# EAGLE design GBZP (EAGLE 8.4.1)
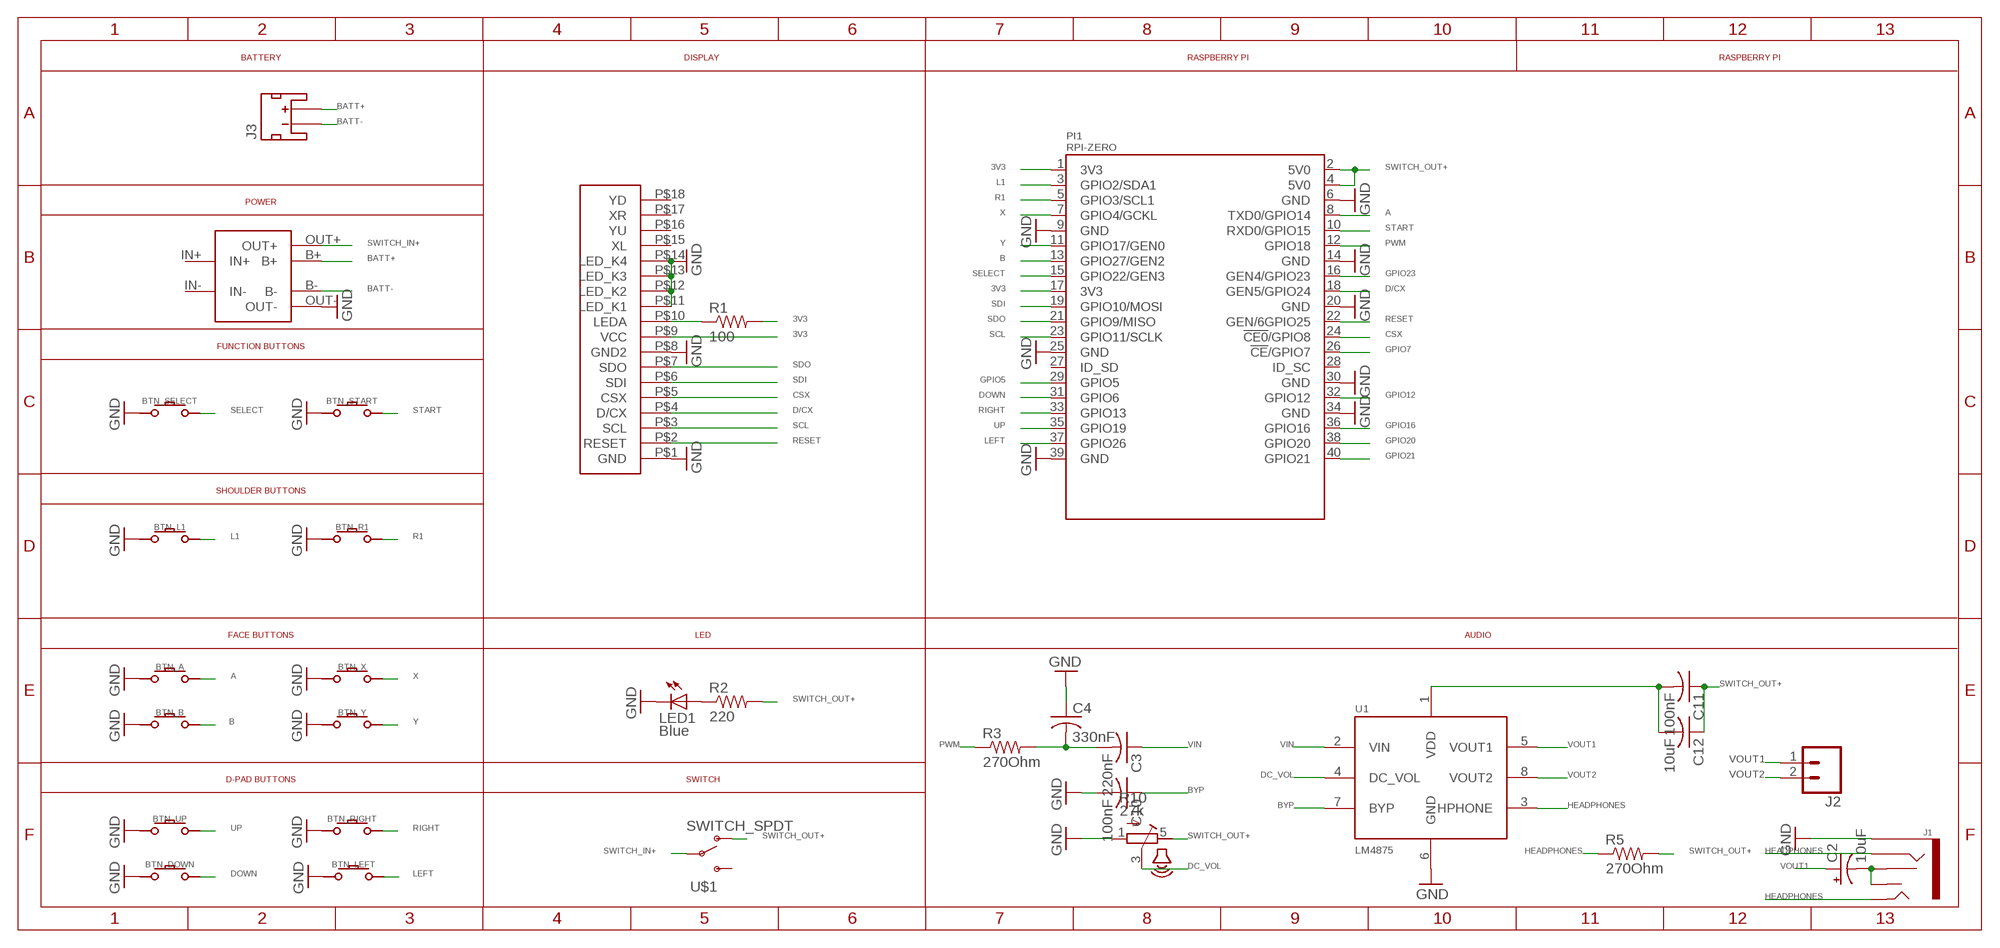
[diagram p0: schematic, sheet 1]

## Parts
BTN_A  PAD+SWITCH+HOLE  [PAD+SWITCH+HOLE]
BTN_B  PAD+SWITCH+HOLE  [PAD+SWITCH+HOLE]
BTN_DOWN  PAD+SWITCH+HOLE  [PAD+SWITCH+HOLE]
BTN_L1  PAD+SWITCH+HOLE  [PAD+SWITCH+HOLE]
BTN_LEFT  PAD+SWITCH+HOLE  [PAD+SWITCH+HOLE]
BTN_R1  PAD+SWITCH+HOLE  [PAD+SWITCH+HOLE]
BTN_RIGHT  PAD+SWITCH+HOLE  [PAD+SWITCH+HOLE]
BTN_SELECT  PAD+SWITCH+HOLE  [PAD+SWITCH+HOLE]
BTN_START  PAD+SWITCH+HOLE  [PAD+SWITCH+HOLE]
BTN_UP  PAD+SWITCH+HOLE  [PAD+SWITCH+HOLE]
BTN_X  PAD+SWITCH+HOLE  [PAD+SWITCH+HOLE]
BTN_Y  PAD+SWITCH+HOLE  [PAD+SWITCH+HOLE]
C2  10uF  10UF-POLAR-EIA3216-16V-10%(TANT)  [EIA3216]
C3  220nF  C-USC0805  [C0805]
C4  330nF  C-USC0805  [C0805]
C10  100nF  C-USC0805  [C0805]
C11  100nF  C-USC0805  [C0805]
C12  10uF  C-USC0805  [C0805]
ILI9341-TFT-2.8  GAMEBOYZEROHANDHELDDISPLAYS-2.8  [GAMEBOYZEROHANDHELDDISPLAYS-2.8]
J1  AUDIO_JACK_3.5MM_PTH  [AUDIO-JACK]
J2  CONN_02  [1X02]
J3  JST_2MM_MALE  [JST-2-SMD]
LED1  Blue  LEDCHIPLED_0805  [CHIPLED_0805]
PI1  RPI-ZERO  [RASPBERRYPI_BASTELSTUBE_V13_RASPI_BOARD_B+_FULL]
POWER1  03962A  [03962A]
R1  100  R-US_R0805  [R0805]
R2  220  R-US_R0805  [R0805]
R3  270Ohm  R-US_R0805  [R0805]
R5  270Ohm  R-US_R0805  [R0805]
R10  27k  VOLUME  [VOLUME]
U1  LM4875  [SOIC8]
U$1  SWITCH_SPDT  [KPS-1290]

## Nets
3V3: ILI9341-TFT-2.8.P$9(VCC) PI1.1(3V3) PI1.17(3V3) R1.2
3V3100OHM: ILI9341-TFT-2.8.P$10(LEDA) R1.1
A: BTN_A.P$ACTIVE PI1.8(TXD0/GPIO14)
B: BTN_B.P$ACTIVE PI1.13(GPIO27/GEN2)
BATT+: J3.2(+) POWER1.B+
BATT-: J3.1(-) POWER1.B-
BYP: C10.1 U1.7(BYP)
CAP_LINE: C11.2 C12.2 U1.1(VDD)
CAP_LINE_JACK: C2.- J1.RSH J1.TSH
CSX: ILI9341-TFT-2.8.P$5(CSX) PI1.24(!CE0!/GPIO8)
D/CX: ILI9341-TFT-2.8.P$4(D/CX) PI1.18(GEN5/GPIO24)
DC_VOL: R10.3(S) U1.4(DC_VOL)
DOWN: BTN_DOWN.P$ACTIVE PI1.31(GPIO6)
GND: BTN_A.P$GND BTN_B.P$GND BTN_DOWN.P$GND BTN_L1.P$GND BTN_LEFT.P$GND BTN_R1.P$GND BTN_RIGHT.P$GND BTN_SELECT.P$GND BTN_START.P$GND BTN_UP.P$GND BTN_X.P$GND BTN_Y.P$GND C4.1 C10.2 ILI9341-TFT-2.8.P$1(GND) ILI9341-TFT-2.8.P$8(GND2) ILI9341-TFT-2.8.P$11(LED_K1) ILI9341-TFT-2.8.P$12(LED_K2) ILI9341-TFT-2.8.P$13(LED_K3) ILI9341-TFT-2.8.P$14(LED_K4) J1.SLEEVE LED1.C PI1.6(GND) PI1.9(GND) PI1.14(GND) PI1.20(GND) PI1.25(GND) PI1.30(GND) PI1.34(GND) PI1.39(GND) POWER1.OUT- R10.1(A) U1.6(GND)
GPIO5: PI1.29(GPIO5)
GPIO7: PI1.26(!CE!/GPIO7)
GPIO12: PI1.32(GPIO12)
GPIO16: PI1.36(GPIO16)
GPIO20: PI1.38(GPIO20)
GPIO21: PI1.40(GPIO21)
GPIO23: PI1.16(GEN4/GPIO23)
HEADPHONES: J1.RING J1.TIP R5.1 U1.3(HPHONE)
L1: BTN_L1.P$ACTIVE PI1.3(GPIO2/SDA1)
LED: LED1.A R2.1
LEFT: BTN_LEFT.P$ACTIVE PI1.37(GPIO26)
N$2: C3.2 C4.2 R3.2
PWM: PI1.12(GPIO18) R3.1
R1: BTN_R1.P$ACTIVE PI1.5(GPIO3/SCL1)
RESET: ILI9341-TFT-2.8.P$2(RESET) PI1.22(GEN/6GPIO25)
RIGHT: BTN_RIGHT.P$ACTIVE PI1.33(GPIO13)
SCL: ILI9341-TFT-2.8.P$3(SCL) PI1.23(GPIO11/SCLK)
SDI: ILI9341-TFT-2.8.P$6(SDI) PI1.19(GPIO10/MOSI)
SDO: ILI9341-TFT-2.8.P$7(SDO) PI1.21(GPIO9/MISO)
SELECT: BTN_SELECT.P$ACTIVE PI1.15(GPIO22/GEN3)
START: BTN_START.P$ACTIVE PI1.10(RXD0/GPIO15)
SWITCH_IN+: POWER1.OUT+ U$1.P
SWITCH_OUT+: C11.1 C12.1 PI1.2(5V0) PI1.4(5V0) R2.2 R5.2 R10.5(E) U$1.O
UP: BTN_UP.P$ACTIVE PI1.35(GPIO19)
VIN: C3.1 U1.2(VIN)
VOUT1: C2.+ J2.1 U1.5(VOUT1)
VOUT2: J2.2 U1.8(VOUT2)
X: BTN_X.P$ACTIVE PI1.7(GPIO4/GCKL)
Y: BTN_Y.P$ACTIVE PI1.11(GPIO17/GEN0)
Unconnected: ILI9341-TFT-2.8.P$15(XL) ILI9341-TFT-2.8.P$16(YU) ILI9341-TFT-2.8.P$17(XR) ILI9341-TFT-2.8.P$18(YD) J3.NC1(PAD1) J3.NC2(PAD2) PI1.27(ID_SD) PI1.28(ID_SC) POWER1.IN+ POWER1.IN- U$1.S

## Notes on the sheet
- BATTERY | DISPLAY | RASPBERRY PI | RASPBERRY PI
- POWER
- FUNCTION BUTTONS
- SHOULDER BUTTONS
- FACE BUTTONS | LED | AUDIO
- D-PAD BUTTONS | SWITCH

## Library data of the parts
BTN_A BTN_B BTN_DOWN BTN_L1 BTN_LEFT BTN_R1 BTN_RIGHT BTN_SELECT BTN_START BTN_UP BTN_X BTN_Y = pad+switch+hole:PAD+SWITCH+HOLE
C2 = SparkFun-Capacitors:10UF-POLAR: 10.0µF polarized capacitors A capacitor is a passive two-terminal electrical component used to store electrical energy temporarily in an electric field.; PROD_ID: CAP-00811
C3 C4 C10-C12 = adafruit:C-US: CAPACITOR, American symbol
ILI9341-TFT-2.8 = GameboyZeroHandheldDisplays:GAMEBOYZEROHANDHELDDISPLAYS-2.8
J1 = SparkFun-Connectors:AUDIO_JACK_3.5MM: Audio Jack 3.5mm variants of PTH and SMT stereo audio jack with bypass switches. SparkFun Products: SparkFun SparkPunk Sound Kit <[https://www.sparkfun.com/products/11177]> - PTH MP3 Trigger <https://www.sparkfun.com/products/13720> -3.5mm SMD SparkFun PicoBoard <https://www.sparkfun.com/products/11888>- 2.5mm SMD; PROD_ID: CONN-08774; SF_ID: PRT-08032
J2 = SparkFun-Connectors:CONN_02: Multi connection point. Often used as Generic Header-pin footprint for 0.1 inch spaced/style header connections On any of the 0.1 inch spaced packages, you can populate with these: Break Away Headers - Straight <https://www.sparkfun.com/products/116> (PRT-00116) Break Away Male Headers - Right Angle <https://www.sparkfun.com/products/553> (PRT-00553) Female Headers <https://www.sparkfun.com/products/115> (PRT-00115) Break Away Headers - Machine Pin <https://www.sparkfun.com/products/117> (PRT-00117) Break Away Female Headers - Swiss Machine Pin <https://www.sparkfun.com/products/743> (PRT-00743) For SCREWTERMINALS and SPRING TERMINALS visit here: Screw Terimnals on SparkFun.com <https://www.sparkfun.com/search/results?term=Screw+Terminals> (5mm/3.5mm/2.54mm spacing) This device is also useful as a general connection point to wire up your design to another part of your project. Our various solder wires solder well into these plated through hole pads. Hook-Up Wire - Assortment (Stranded, 22 AWG) <https://www.sparkfun.com/products/11375> (PRT-11375) Hook-Up Wire - Assortment (Solid Core, 22 AWG) <https://www.sparkfun.com/products/11367> (PRT-11367) View the entire wire category on our website here <https://www.sparkfun.com/categories/141> Special notes: Molex polarized connector foot print use with: PRT-08233 with associated crimp pins and housings. 2.54_SCREWTERM for use with PRT-10571. 3.5mm Screw Terminal footprints for PRT-08084 5mm Screw Terminal footprints for use with PRT-08432
J3 = SparkFun-Connectors:JST_2MM_MALE: Mates to single-cell LiPo batteries. CONN-11443 Now with smashable polarity marks!; BTM_NEG: -; BTM_POS: +; PROD_ID: CONN-11443; TOP_NEG: -; TOP_POS: +
LED1 = adafruit:LED: LED OSRAM: - CHIPLED LG R971, LG N971, LY N971, LG Q971, LY Q971, LO R971, LY R971 LH N974, LH R974 LS Q976, LO Q976, LY Q976 LO Q996 - Hyper CHIPLED LW Q18S LB Q993, LB Q99A, LB R99A - SideLED LS A670, LO A670, LY A670, LG A670, LP A670 LB A673, LV A673, LT A673, LW A673 LH A674 LY A675 LS A676, LA A676, LO A676, LY A676, LW A676 LS A679, LY A679, LG A679 - Hyper Micro SIDELED® LS Y876, LA Y876, LO Y876, LY Y876 LT Y87S - SmartLED LW L88C, LW L88S LB L89C, LB L89S, LG L890 LS L89K, LO L89K, LY L89K LS L896, LA L896, LO L896, LY L896 - TOPLED LS T670, LO T670, LY T670, LG T670, LP T670 LSG T670, LSP T670, LSY T670, LOP T670, LYG T670 LG T671, LOG T671, LSG T671 LB T673, LV T673, LT T673, LW T673 LH T674 LS T676, LA T676, LO T676, LY T676, LB T676, LH T676, LSB T676, LW T676 LB T67C, LV T67C, LT T67C, LS T67K, LO T67K, LY T67K, LW E67C LS E67B, LA E67B, LO E67B, LY E67B, LB E67C, LV E67C, LT E67C LW T67C LS T679, LY T679, LG T679 LS T770, LO T770, LY T770, LG T770, LP T770 LB T773, LV T773, LT T773, LW T773 LH T774 LS E675, LA E675, LY E675, LS T675 LS T776, LA T776, LO T776, LY T776, LB T776 LHGB T686 LT T68C, LB T68C - Hyper Mini TOPLED® LB M676 - Mini TOPLED Santana® LG M470 LS M47K, LO M47K, LY M47K Source: http://www.osram.convergy.de/
PI1 = RPI-Zero:RPI-ZERO
POWER1 = 03962A:03962A
R1-R3 R5 = adafruit:R-US_: RESISTOR, American symbol
R10 = GBA:VOLUME
U1 = texas:LM4875
U$1 = SparkFun-Retired:SWITCH_SPDT: SWCH-10651 Side-actuated SPDT slide switch, as used on the Arduino Pro; PROD_ID: SWCH-10651

## Board
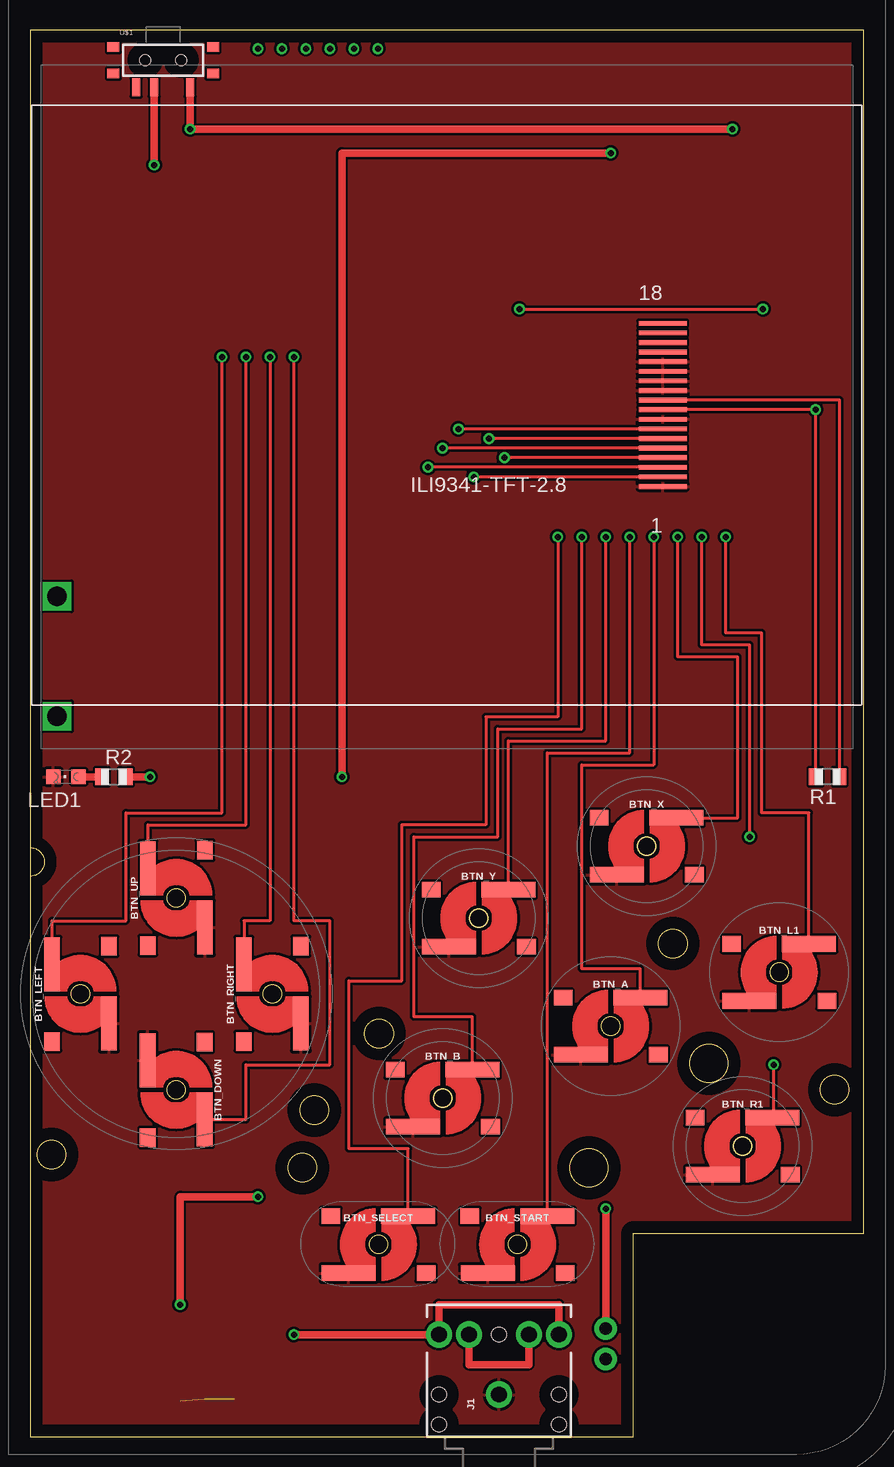
[diagram p1: board, top side]
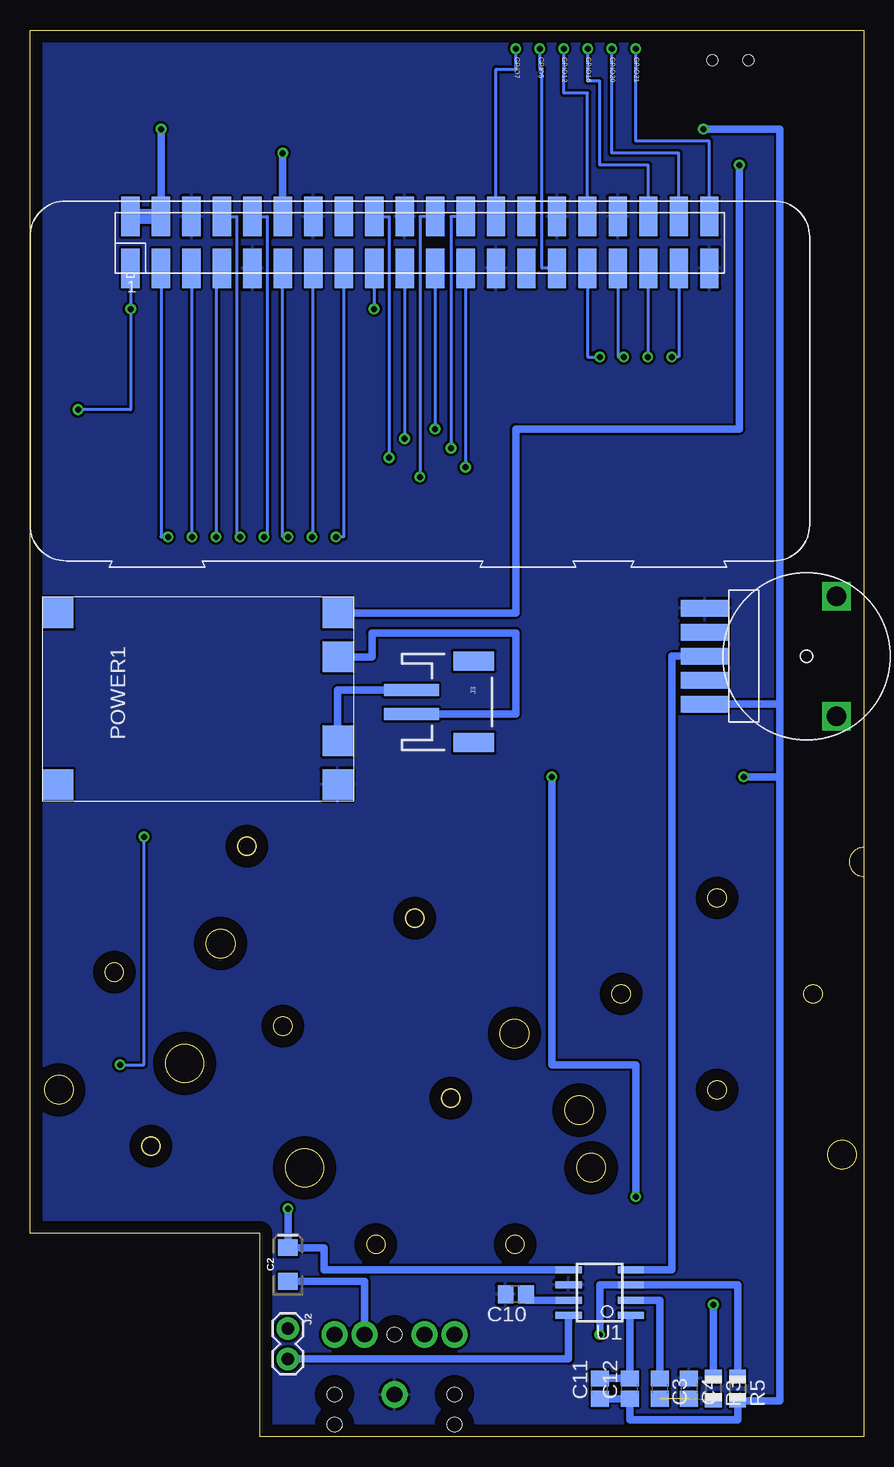
[diagram p2: board, bottom side, seen from below]

Size 69.5 x 117.25 mm. Coordinates in mm from the lower left corner, seen from the top.
Outline: 0,46.7 0,0 50.3,0 50.3,16.95 69.5,16.95 69.5,117.25 0,117.25 0,49.1
Outline: 0,49.1 0,46.7
Outline: 0,49.1 arc-180 0,46.7
Outline: circle at 1.8,23.5 radius 1.2
Outline: circle at 67.1,28.9 radius 1.2
Outline: circle at 56.6,31.1 radius 1.6
Outline: circle at 46.6,22.4 radius 1.6
Outline: circle at 29.1,33.6 radius 1.2
Outline: circle at 23.7,27.2 radius 1.2
Outline: circle at 22.7,22.4 radius 1.2
Outline: circle at 53.6,41.1 radius 1.2
Outline: circle at 34.42,28.21 radius 0.75
Outline: circle at 37.42,43.21 radius 0.75
Outline: circle at 51.42,49.21 radius 0.75
Outline: circle at 59.42,24.21 radius 0.75
Copper layers (1*16): Top 0.035mm / dielectric 1.5mm / Bottom 0.035mm
Design rules "default": minimum track width 10mil, minimum drill 24mil, track to track 8mil, track to pad 8mil, pad to pad 8mil, via to via 8mil, smd to smd 8mil, copper to edge 40mil, drill to drill 8mil, minimum pad ring 10mil, minimum via ring 8mil, stop-mask expansion 4mil, vias tented up to drill 0mil, thermal gap 10mil

### Footprints (pad centres in the part's own frame; a part is rotated, then mirrored left to right if it is on the bottom)
PAD+SWITCH+HOLE = smd 4.5 x 1.3: P$ACTIVE 2.475,2.365; P$GND -2.475,-2.385 | smd 1.55 x 1.3: P$NC -3.975,2.365; P$NC2 3.975,-2.385 | hole 1.5: 0,0
EIA3216 = smd 1.4 x 1.6: + 1.4,0; - -1.4,0
C0805 = smd 1.3 x 1.5: 1 -0.85,0; 2 0.85,0
GAMEBOYZEROHANDHELDDISPLAYS-2.8 = smd 4 x 0.4: P$1 -18,6.8; P$2 -18,6; P$3 -18,5.2; P$4 -18,4.4; P$5 -18,3.6; P$6 -18,2.8; P$7 -18,2; P$8 -18,1.2; P$9 -18,0.4; P$10 -18,-0.4; P$11 -18,-1.2; P$12 -18,-2; P$13 -18,-2.8; P$14 -18,-3.6; P$15 -18,-4.4; P$16 -18,-5.2; P$17 -18,-6; P$18 -18,-6.8
AUDIO-JACK = drill 1.3 pad 2.184: RING 5,5; RSH 5,2.5; SLEEVE 0,0; TIP 5,-5; TSH 5,-2.5 | hole 1.2: 0,5; -2.5,5; -2.5,-5; 0,-5; 5,0
1X02 = drill 1.016 pad 1.88: 1 0,0; 2 2.54,0
JST-2-SMD = smd 1 x 4.6: 1 -1,-3.7; 2 1,-3.7 | smd 1.6 x 3.4: NC1 -3.4,1.5; NC2 3.4,1.5
CHIPLED_0805 = smd 1.2 x 1.2: A 0,-1.05; C 0,1.05
RASPBERRYPI_BASTELSTUBE_V13_RASPI_BOARD_B+_FULL = smd 1.524 x 3.302: 1 8.382,24.384; 2 8.382,28.702; 3 10.922,24.384; 4 10.922,28.702; 5 13.462,24.384; 6 13.462,28.702; 7 16.002,24.384; 8 16.002,28.702; 9 18.542,24.384; 10 18.542,28.702; 11 21.082,24.384; 12 21.082,28.702; 13 23.622,24.384; 14 23.622,28.702; 15 26.162,24.384; 16 26.162,28.702; 17 28.702,24.384; 18 28.702,28.702; 19 31.242,24.384; 20 31.242,28.702; 21 33.782,24.384; 22 33.782,28.702; 23 36.322,24.384; 24 36.322,28.702; 25 38.862,24.384; 26 38.862,28.702; 27 41.402,24.384; 28 41.402,28.702; 29 43.942,24.384; 30 43.942,28.702; 31 46.482,24.384; 32 46.482,28.702; 33 49.022,24.384; 34 49.022,28.702; 35 51.562,24.384; 36 51.562,28.702; 37 54.102,24.384; 38 54.102,28.702; 39 56.642,24.384; 40 56.642,28.702
03962A = smd 2.54 x 2.54: B+ 12,1.35; B- 5,1.35; IN+ 15.65,24.65; IN- 1.35,24.65; OUT+ 15.65,1.35; OUT- 1.35,1.35
R0805 = smd 1.1 x 1.4: 1 -1,0; 2 1,0
VOLUME = smd 1.4 x 4: 1 -4,-2; 2 -2,-2; 3 0,-2; 4 2,-2; 5 4,-2 | drill 1.6 square: P$6 -5,9; P$7 5,9
SOIC8 = smd 0.6 x 2.2: 1 -1.905,-2.6; 2 -0.635,-2.6; 3 0.635,-2.6; 4 1.905,-2.6; 5 1.905,2.6; 6 0.635,2.6; 7 -0.635,2.6; 8 -1.905,2.6
KPS-1290 = smd 0.7 x 1.5: O -2.25,2.25; P 0.75,2.25; S 2.25,2.25 | smd 1 x 0.8: P$1 -4.15,1.1; P$2 -4.15,-1.1; P$3 4.15,-1.1; P$4 4.15,1.1 | hole 0.9: -1.5,0; 1.5,0

### Placement (x,y rotation side)
BTN_A  48.42,34.21 0 top
BTN_B  34.42,28.21 0 top
BTN_DOWN  12.2,28.9 270 top
BTN_L1  62.47,38.7 0 top
BTN_LEFT  4.2,36.9 90 top
BTN_R1  59.42,24.21 0 top
BTN_RIGHT  20.2,36.9 90 top
BTN_SELECT  29.05,16.01 0 top
BTN_START  40.66,16.01 0 top
BTN_UP  12.2,44.9 90 top
BTN_X  51.42,49.21 0 top
BTN_Y  37.42,43.21 0 top
C2  48,14.35 90 bottom
C3  17,4 270 bottom
C4  14.55,4 270 bottom
C10  29,11.87 180 bottom
C11  22,4 90 bottom
C12  19.5,4 90 bottom
ILI9341-TFT-2.8  34.75,86 180 top
J1  39.1,3.5 90 top
J2  48,9 270 bottom
J3  34,61.25 270 bottom
LED1  3,55 90 top
PI1  69.5,73 0 bottom
POWER1  42.5,53 90 bottom
R1  66.5,55 180 top
R2  7,55 0 top
R3  12.53,4 270 bottom
R5  10.5,4 270 bottom
R10  11.25,65.05 270 bottom
U1  22,12 90 bottom
U$1  11.1,114.72 180 top

### Tracks (layer width: path | path; a pad name or v marks a point on that pad's centre or on a via)
3V3  (via drill 0.5)
  Top 0.254: R1.2 v65.5,85.6 ILI9341-TFT-2.8.P$9 | v40.8,94 v61.12,94
  Bottom 0.254: v65.5,85.6 61.12,85.6 v61.12,94 PI1.1 | PI1.17 v40.8,94
3V3100OHM
  Top 0.254: R1.1 67.5,86.4 ILI9341-TFT-2.8.P$10
A  (via drill 0.5)
  Top 0.254: v52,75 52,56 46,56 46,39 50.9,39 BTN_A.P$ACTIVE
  Bottom 0.254: PI1.8 52.25,101.7 52.25,75 v52,75
B  (via drill 0.5)
  Top 0.254: BTN_B.P$ACTIVE 36.9,35 32,35 32,50 39,50 39,59 46,59 v46,75
  Bottom 0.254: PI1.13 45.88,75 v46,75
BATT+
  Bottom 0.61: J3.2 29,60.25 29,67 41,67 41,65 POWER1.B+
BATT-
  Bottom 0.61: J3.1 43.85,62.25 POWER1.B-
BYP
  Bottom 0.61: U1.7 28.15,11.37 C10.1
CAP_LINE
  Bottom 0.61: U1.1 19.5,10.1 C12.2 C11.2
CAP_LINE_JACK
  Top 0.61: J1.RSH 36.6,6 41.6,6 J1.TSH
  Bottom 0.61: C2.- 41.6,12.95 J1.TSH
CSX  (via drill 0.5)
  Top 0.254: ILI9341-TFT-2.8.P$5 v34.4,82.4
  Bottom 0.254: PI1.24 34.4,101.7 v34.4,82.4
D/CX  (via drill 0.5)
  Top 0.254: ILI9341-TFT-2.8.P$4 v39.55,81.6
  Bottom 0.254: PI1.18 39.55,101.7 v39.55,81.6
DC_VOL
  Bottom 0.61: R10.3 16,65.05 16,13.9 U1.4
DOWN  (via drill 0.5)
  Top 0.254: BTN_DOWN.P$ACTIVE 18,26.43 18,31 25,31 25,43 22,43 v22,90
  Bottom 0.254: PI1.31 23.02,90 v22,90
GND
  pour Top: 0,0 50.3,0 50.3,16.95 69.5,16.95 69.5,117.25 0,117.25
  pour Bottom: 0,0 50.3,0 50.3,16.95 69.5,16.95 69.5,117.25 0,117.25
GPIO5  (via drill 0.5)
  Bottom 0.254: PI1.29 26.8,97.38 26.8,114 27,114 v27,115.7
GPIO7  (via drill 0.5)
  Bottom 0.254: PI1.26 30.64,114 29,114 v29,115.7
GPIO12  (via drill 0.5)
  Bottom 0.254: PI1.32 23.02,112 25,112 v25,115.7
GPIO16  (via drill 0.5)
  Bottom 0.254: PI1.36 17.94,106 22,106 22,113 23,113 v23,115.7
GPIO20  (via drill 0.5)
  Bottom 0.254: PI1.38 15.4,107 21,107 v21,115.7
GPIO21  (via drill 0.5)
  Bottom 0.254: PI1.40 12.86,108 19,108 v19,115.7
HEADPHONES  (via drill 0.5)
  Top 0.61: v22,8.5 J1.RING 34.1,11 44.1,11 J1.TIP
  Bottom 0.61: R5.1 10.5,12.63 U1.3 22,12.63 v22,8.5
L1  (via drill 0.5)
  Top 0.254: BTN_L1.P$ACTIVE 64.94,52 61,52 61,67 58,67 v58,75
  Bottom 0.254: PI1.3 58.58,75 v58,75
LED
  Top 0.61: R2.1 LED1.A
LEFT  (via drill 0.5)
  Top 0.254: BTN_LEFT.P$ACTIVE 1.83,43 8,43 8,52 16,52 v16,90
  Bottom 0.254: PI1.37 15.4,90 v16,90
N$2  (2 unrouted)
PWM  (via drill 0.5)
  Top 0.61: v12.53,11 12.53,20 v19,20 | v26,55 26,107 v48.42,107 48,107
  Bottom 0.61: R3.1 v12.53,11 | v19,20 19,31 26,31 v26,55 | PI1.12 v48.42,107
R1  (via drill 0.5)
  Top 0.254: BTN_R1.P$ACTIVE 62,26.57 v62,31 | v60,50 60,66 56,66 v56,75
  Bottom 0.254: PI1.5 56.04,75 v56,75 | v62,31 60,31 v60,50
RESET  (via drill 0.5)
  Top 0.254: ILI9341-TFT-2.8.P$2 v37,80
  Bottom 0.254: PI1.22 37,101.7 v37,80
RIGHT  (via drill 0.5)
  Top 0.254: v20,90 20,43 17.84,43 BTN_RIGHT.P$ACTIVE
  Bottom 0.254: PI1.33 20.48,90 v20,90
SCL  (via drill 0.5)
  Top 0.254: ILI9341-TFT-2.8.P$3 v33.18,80.8
  Bottom 0.254: PI1.23 v33.18,80.8 33.2,80.8
SDI  (via drill 0.5)
  Top 0.254: ILI9341-TFT-2.8.P$6 v38.26,83.2
  Bottom 0.254: PI1.19 v38.26,83.2
SDO  (via drill 0.5)
  Top 0.254: ILI9341-TFT-2.8.P$7 v35.72,84
  Bottom 0.254: PI1.21 v35.72,84
  Bottom 0.406: v35.72,84 36,84
SELECT  (via drill 0.5)
  Top 0.254: BTN_SELECT.P$ACTIVE 31.53,24 26.6,24 26.6,38 31,38 31,51 38,51 38,60 44,60 v44,75
  Bottom 0.254: PI1.15 43.34,75 v44,75
START  (via drill 0.5)
  Top 0.254: BTN_START.P$ACTIVE 43.13,57 50,57 v50,75
  Bottom 0.254: PI1.10 49.7,101.7 49.7,75 v50,75
SWITCH_IN+  (via drill 0.5)
  Top 0.61: U$1.P v10.35,106
  Bottom 0.61: POWER1.OUT+ 29,68.65 29,84 10.35,84 v10.35,106
SWITCH_OUT+  (via drill 0.5)
  Top 0.61: U$1.O v13.35,109 v58.58,109 | R2.2 v10,55 | v58.58,109 58.6,109 v58.58,109
  Bottom 0.61: v58.58,109 PI1.4 | v13.35,109 7,109 7,61.05 | 7,61.05 R10.5 | 7,55 7,61.05 | 7,55 7,3 R5.2 10.5,1.4 19.5,1.4 C12.1 C11.1 | v10,55 7,55
  Bottom 1.27: PI1.4 PI1.2
UP  (via drill 0.5)
  Top 0.254: BTN_UP.P$ACTIVE 9.84,51 18,51 v18,90
  Bottom 0.254: PI1.35 18,97.38 v18,90
VIN
  Bottom 0.61: C3.1 17,11.37 U1.2
VOUT1  (via drill 0.5)
  Top 0.61: J2.1 v48,19
  Bottom 0.61: U1.5 45,13.9 45,15.75 C2.+ v48,19
VOUT2
  Bottom 0.61: U1.8 24.6,6.46 J2.2
X  (via drill 0.5)
  Top 0.254: BTN_X.P$ACTIVE 59,51.58 59,65 54,65 v54,75
  Bottom 0.254: PI1.7 54,97.38 v54,75
Y  (via drill 0.5)
  Top 0.254: BTN_Y.P$ACTIVE 39.9,58 48,58 v48,75
  Bottom 0.254: PI1.11 48.42,75 v48,75

### Text on the board
bPlace: GPIO21 / / GPIO20 / / GPIO16 / / GPIO12 / / GPIO5 / / GPIO7